# EAGLE schematic Pong_Schematic_v5 (EAGLE 9.7.0)
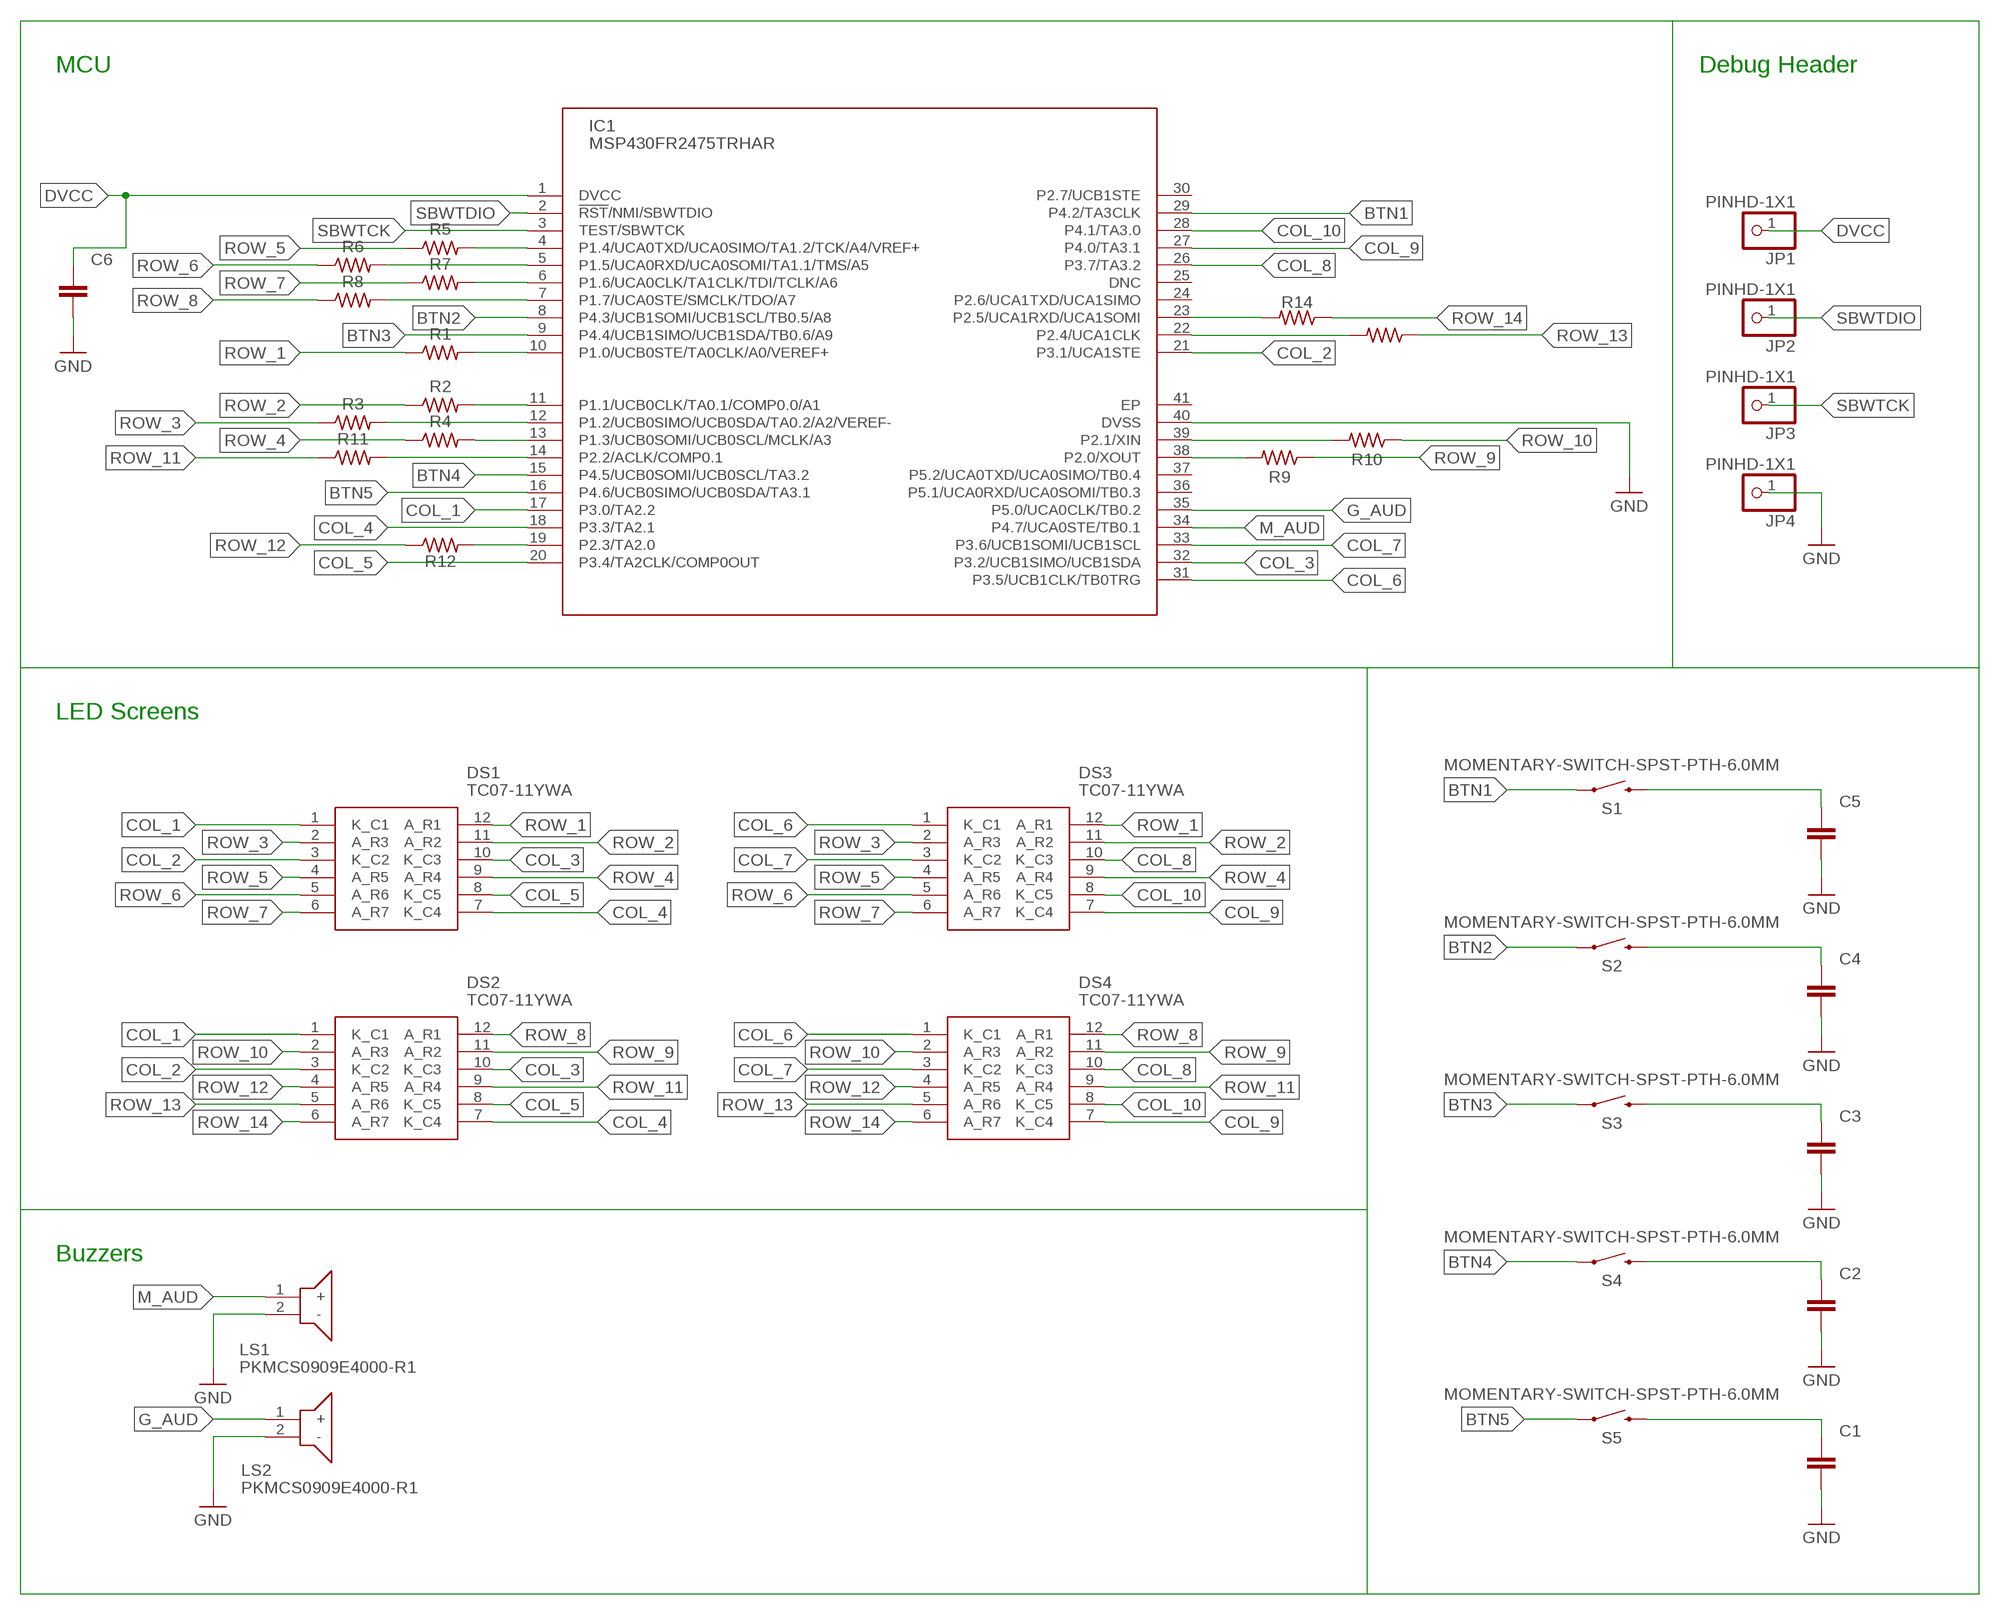
[diagram p0: schematic, sheet 1]

## Parts
C1  C_CHIP-0805(2012-METRIC)  [CAPC2012X110]
C2  C_CHIP-0805(2012-METRIC)  [CAPC2012X110]
C3  C_CHIP-0805(2012-METRIC)  [CAPC2012X110]
C4  C_CHIP-0805(2012-METRIC)  [CAPC2012X110]
C5  C_CHIP-0805(2012-METRIC)  [CAPC2012X110]
C6  C_CHIP-0805(2012-METRIC)  [CAPC2012X110]
DS1  TC07-11YWA  [TC0711YWA]
DS2  TC07-11YWA  [TC0711YWA]
DS3  TC07-11YWA  [TC0711YWA]
DS4  TC07-11YWA  [TC0711YWA]
IC1  MSP430FR2475TRHAR  [QFN50P600X600X100-41N]
JP1  PINHD-1X1  [1X01]
JP2  PINHD-1X1  [1X01]
JP3  PINHD-1X1  [1X01]
JP4  PINHD-1X1  [1X01]
LS1  PKMCS0909E4000-R1  [PKMCS0909E4000R1]
LS2  PKMCS0909E4000-R1  [PKMCS0909E4000R1]
R1  R-US_CHIP-0805(2012-METRIC)  [RESC2012X65]
R2  R-US_CHIP-0805(2012-METRIC)  [RESC2012X65]
R3  R-US_CHIP-0805(2012-METRIC)  [RESC2012X65]
R4  R-US_CHIP-0805(2012-METRIC)  [RESC2012X65]
R5  R-US_CHIP-0805(2012-METRIC)  [RESC2012X65]
R6  R-US_CHIP-0805(2012-METRIC)  [RESC2012X65]
R7  R-US_CHIP-0805(2012-METRIC)  [RESC2012X65]
R8  R-US_CHIP-0805(2012-METRIC)  [RESC2012X65]
R9  R-US_CHIP-0805(2012-METRIC)  [RESC2012X65]
R10  R-US_CHIP-0805(2012-METRIC)  [RESC2012X65]
R11  R-US_CHIP-0805(2012-METRIC)  [RESC2012X65]
R12  R-US_CHIP-0805(2012-METRIC)  [RESC2012X65]
R13  R-US_CHIP-0805(2012-METRIC)  [RESC2012X65]
R14  R-US_CHIP-0805(2012-METRIC)  [RESC2012X65]
S1  MOMENTARY-SWITCH-SPST-PTH-6.0MM  [TACTILE_SWITCH_PTH_6.0MM]
S2  MOMENTARY-SWITCH-SPST-PTH-6.0MM  [TACTILE_SWITCH_PTH_6.0MM]
S3  MOMENTARY-SWITCH-SPST-PTH-6.0MM  [TACTILE_SWITCH_PTH_6.0MM]
S4  MOMENTARY-SWITCH-SPST-PTH-6.0MM  [TACTILE_SWITCH_PTH_6.0MM]
S5  MOMENTARY-SWITCH-SPST-PTH-6.0MM  [TACTILE_SWITCH_PTH_6.0MM]

## Nets
BTN1: IC1.29(P4.2/TA3CLK) S1.1
BTN2: IC1.8(P4.3/UCB1SOMI/UCB1SCL/TB0.5/A8) S2.1
BTN3: IC1.9(P4.4/UCB1SIMO/UCB1SDA/TB0.6/A9) S3.1
BTN4: IC1.15(P4.5/UCB0SOMI/UCB0SCL/TA3.2) S4.1
BTN5: IC1.16(P4.6/UCB0SIMO/UCB0SDA/TA3.1) S5.1
COL_1: DS1.1(K_C1) DS2.1(K_C1) IC1.17(P3.0/TA2.2)
COL_2: DS1.3(K_C2) DS2.3(K_C2) IC1.21(P3.1/UCA1STE)
COL_3: DS1.10(K_C3) DS2.10(K_C3) IC1.32(P3.2/UCB1SIMO/UCB1SDA)
COL_4: DS1.7(K_C4) DS2.7(K_C4) IC1.18(P3.3/TA2.1)
COL_5: DS1.8(K_C5) DS2.8(K_C5) IC1.20(P3.4/TA2CLK/COMP0OUT)
COL_6: DS3.1(K_C1) DS4.1(K_C1) IC1.31(P3.5/UCB1CLK/TB0TRG)
COL_7: DS3.3(K_C2) DS4.3(K_C2) IC1.33(P3.6/UCB1SOMI/UCB1SCL)
COL_8: DS3.10(K_C3) DS4.10(K_C3) IC1.26(P3.7/TA3.2)
COL_9: DS3.7(K_C4) DS4.7(K_C4) IC1.27(P4.0/TA3.1)
COL_10: DS3.8(K_C5) DS4.8(K_C5) IC1.28(P4.1/TA3.0)
DVCC: C6.1 IC1.1(DVCC) JP1.1
G_AUD: IC1.35(P5.0/UCA0CLK/TB0.2) LS2.1(+)
GND: C1.2 C2.2 C3.2 C4.2 C5.2 C6.2 IC1.40(DVSS) JP4.1 LS1.2(-) LS2.2(-)
M_AUD: IC1.34(P4.7/UCA0STE/TB0.1) LS1.1(+)
N$1: IC1.10(P1.0/UCB0STE/TA0CLK/A0/VEREF+) R1.2
N$2: IC1.11(P1.1/UCB0CLK/TA0.1/COMP0.0/A1) R2.2
N$3: IC1.12(P1.2/UCB0SIMO/UCB0SDA/TA0.2/A2/VEREF-) R3.2
N$4: IC1.13(P1.3/UCB0SOMI/UCB0SCL/MCLK/A3) R4.2
N$5: IC1.4(P1.4/UCA0TXD/UCA0SIMO/TA1.2/TCK/A4/VREF+) R5.2
N$6: IC1.5(P1.5/UCA0RXD/UCA0SOMI/TA1.1/TMS/A5) R6.2
N$7: IC1.6(P1.6/UCA0CLK/TA1CLK/TDI/TCLK/A6) R7.2
N$8: IC1.7(P1.7/UCA0STE/SMCLK/TDO/A7) R8.2
N$9: IC1.38(P2.0/XOUT) R9.2
N$10: IC1.39(P2.1/XIN) R10.2
N$11: IC1.14(P2.2/ACLK/COMP0.1) R11.2
N$12: IC1.19(P2.3/TA2.0) R12.2
N$13: IC1.22(P2.4/UCA1CLK) R13.2
N$14: IC1.23(P2.5/UCA1RXD/UCA1SOMI) R14.2
N$18: C1.1 S5.3
N$19: C2.1 S4.3
N$20: C3.1 S3.3
N$21: C4.1 S2.3
N$22: C5.1 S1.3
ROW_1: DS1.12(A_R1) DS3.12(A_R1) R1.1
ROW_2: DS1.11(A_R2) DS3.11(A_R2) R2.1
ROW_3: DS1.2(A_R3) DS3.2(A_R3) R3.1
ROW_4: DS1.9(A_R4) DS3.9(A_R4) R4.1
ROW_5: DS1.4(A_R5) DS3.4(A_R5) R5.1
ROW_6: DS1.5(A_R6) DS3.5(A_R6) R6.1
ROW_7: DS1.6(A_R7) DS3.6(A_R7) R7.1
ROW_8: DS2.12(A_R1) DS4.12(A_R1) R8.1
ROW_9: DS2.11(A_R2) DS4.11(A_R2) R9.1
ROW_10: DS2.2(A_R3) DS4.2(A_R3) R10.1
ROW_11: DS2.9(A_R4) DS4.9(A_R4) R11.1
ROW_12: DS2.4(A_R5) DS4.4(A_R5) R12.1
ROW_13: DS2.5(A_R6) DS4.5(A_R6) R13.1
ROW_14: DS2.6(A_R7) DS4.6(A_R7) R14.1
SBWTCK: IC1.3(TEST/SBWTCK) JP3.1
SBWTDIO: IC1.2(!RST!/NMI/SBWTDIO) JP2.1
Unconnected: IC1.24(P2.6/UCA1TXD/UCA1SIMO) IC1.25(DNC) IC1.30(P2.7/UCB1STE) IC1.36(P5.1/UCA0RXD/UCA0SOMI/TB0.3) IC1.37(P5.2/UCA0TXD/UCA0SIMO/TB0.4) IC1.41(EP)

## Buses
B$1

## Notes on the sheet
- MCU | Debug Header
- LED Screens
- Buzzers

## Library data of the parts
C1-C6 = Capacitor:C: Capacitor - Generic; CATEGORY: Capacitor
DS1-DS4 = TC07-11YWA:TC07-11YWA: LED Displays & Accessories Dot Matrix Yel 588nm Common Cathode Source: Datasheet <https://componentsearchengine.com/Datasheets/1/TC07-11YWA.pdf>; DESCRIPTION: LED Displays & Accessories Dot Matrix Yel 588nm Common Cathode; HEIGHT: 6.65mm; MANUFACTURER_NAME: Kingbright; MANUFACTURER_PART_NUMBER: TC07-11YWA; MOUSER_PART_NUMBER: 604-TC07-11YWA; MOUSER_PRICE-STOCK: https://www.mouser.com/Search/Refine.aspx?Keyword=604-TC07-11YWA
IC1 = Library:MSP430FR2475TRHAR: MCU 16-bit MSP430 RISC 32.5KB FRAM 3.3V 40-Pin VQFN EP T/R Source: Datasheet <https://www.arrow.com/en/products/msp430fr2475trhar/texas-instruments>; DESCRIPTION: MCU 16-bit MSP430 RISC 32.5KB FRAM 3.3V 40-Pin VQFN EP T/R; HEIGHT: 1mm; MANUFACTURER_NAME: Texas Instruments; MANUFACTURER_PART_NUMBER: MSP430FR2475TRHAR; MOUSER_PART_NUMBER: 595-SP430FR2475TRHAR; MOUSER_PRICE-STOCK: https://www.mouser.co.uk/ProductDetail/Texas-Instruments/MSP430FR2475TRHAR?qs=vLWxofP3U2x%252BBxUsAGdh%2Fw%3D%3D
JP1-JP4 = Connector:PINHD-1X1: PIN HEADER; CATEGORY: CONNECTOR; SUB-CATEGORY: PIN-HEADER
LS1 LS2 = PKMCS0909E4000-R1:PKMCS0909E4000-R1: Piezo Buzzer 9x9mm 4kHz 1.9mm Murata Maximum of +/-12.5 V 65dB SMD Sounder External Piezo Buzzer, Maximum of 4 kHz Source: Datasheet <http://www.murata.com/~/media/webrenewal/products/sound/sounder/vppt-buzj083-d.ashx>; DESCRIPTION: Piezo Buzzer 9x9mm 4kHz 1.9mm Murata Maximum of +/-12.5 V 65dB SMD Sounder External Piezo Buzzer, Maximum of 4 kHz; HEIGHT: 1.9mm; MANUFACTURER_NAME: Murata Electronics; MANUFACTURER_PART_NUMBER: PKMCS0909E4000-R1; MOUSER_PART_NUMBER: 81-PKMCS0909E4000-R1; MOUSER_PRICE-STOCK: https://www.mouser.co.uk/ProductDetail/Murata-Electronics/PKMCS0909E4000-R1?qs=YqJ97pz8ambMt2Tf4F1Kig%3D%3D
R1-R14 = Resistor:R-US: Resistor Fixed - ANSI; CATEGORY: Resistor; SUB-CATEGORY: Fixed
S1-S5 = SparkFun-Switches:MOMENTARY-SWITCH-SPST: Momentary Switch (Pushbutton) - SPST Normally-open (NO) SPST momentary switches (buttons, pushbuttons). Variants PTH-12MM - 12mm square, through-hole Momentary Pushbutton Switch - 12mm Square <https://www.sparkfun.com/products/9190> (COM-09190) PTH-6.0MM, PTH-6.0MM-KIT - 6.0mm square, through-hole Mini Pushbutton Switch <https://www.sparkfun.com/products/97> (COM-00097) KIT package intended for soldering kit's - only one side of pads' copper is exposed. PTH-RIGHT-ANGLE-KIT - Right-angle, through-hole Right Angle Tactile Button <https://www.sparkfun.com/products/10791> - Used on SparkFun BigTime Watch Kit <https://www.sparkfun.com/products/11734> SMD-12MM - 12mm square, surface-mount Tactile Button - SMD (12mm) <https://www.sparkfun.com/products/12993> (COM-12993) Used on SparkFun PicoBoard <https://www.sparkfun.com/products/11888> SMD-4.5MM - 4.5mm Square Trackball Switch Used on SparkFun Blackberry Trackballer Breakout <https://www.sparkfun.com/products/13169> SMD-4.6MMX2.8MM - 4.60mm x 2.80mm, surface mount Used on SparkFun SAMD21 Mini Breakout <https://www.sparkfun.com/products/13664> SMD-5.2MM, SMD-5.2-REDUNDANT - 5.2mm square, surface-mount Mini Pushbutton Switch - SMD <https://www.sparkfun.com/products/8720> (COM-08720) Used on Arduino Pro Mini <https://www.sparkfun.com/products/11114> REDUNDANT package connects both switch circuits together SMD-6.0X3.5MM - 6.0 x 3.5mm, surface mount Momentary Reset Switch SMD <https://www.sparkfun.com/products/8229> (COM-08229) SMD-6.2MM-TALL - 6.2mm square, surface mount Tactile Button - SMD (6mm) <https://www.sparkfun.com/products/12992> Used on SparkFun Digital Sandbox <https://www.sparkfun.com/products/12651> SMD-RIGHT-ANGLE - Right-angle, surface mount Used on SparkFun Block for Intel® Edison - Arduino <https://www.sparkfun.com/products/13036>; PROD_ID: SWCH-08441; SF_SKU: COM-00097